# EAGLE design Arduino_Clock_Dividerx4_board2 (EAGLE 9.1.1)
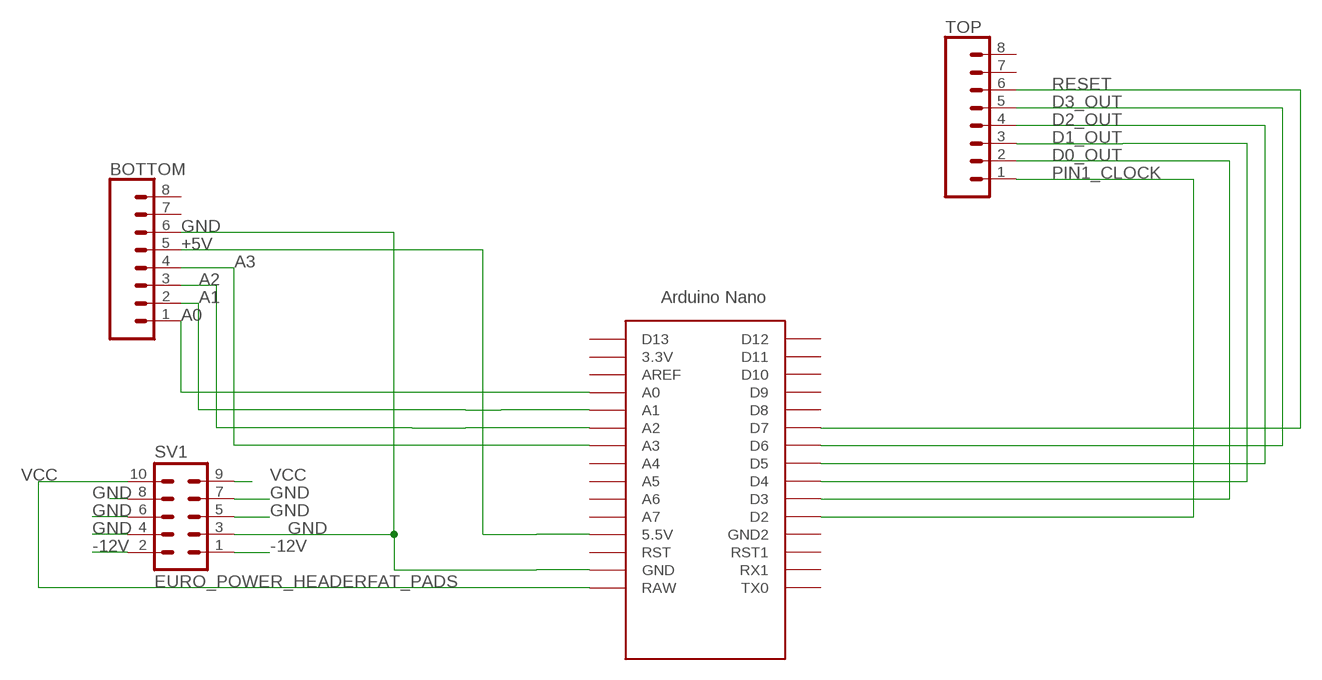
[diagram p0: schematic, sheet 1]

## Parts
BOTTOM  CONN_08LONGPADS  [1X08_LONGPADS]
SV1  EURO_POWER_HEADERFAT_PADS  [EURO_PWR_HEADER_FAT]
TOP  CONN_08LONGPADS  [1X08_LONGPADS]
U$1  NANO  [NANO]

## Nets
+5V: BOTTOM.5 U$1.5V(5.5V)
-12V: SV1.1 SV1.2
A0: BOTTOM.1 U$1.A0
A1: BOTTOM.2 U$1.A1
A2: BOTTOM.3 U$1.A2
A3: BOTTOM.4 U$1.A3
D0_OUT: TOP.2 U$1.D3
D1_OUT: TOP.3 U$1.D4
D2_OUT: TOP.4 U$1.D5
D3_OUT: TOP.5 U$1.D6
GND: BOTTOM.6 SV1.3 SV1.4 SV1.5 SV1.6 SV1.7 SV1.8 U$1.GND
PIN1_CLOCK: TOP.1 U$1.D2
RESET: TOP.6 U$1.D7
VCC: SV1.9 SV1.10 U$1.RAW
Unconnected: BOTTOM.7 BOTTOM.8 TOP.7 TOP.8 U$1.3.3V U$1.A4 U$1.A5 U$1.A6 U$1.A7 U$1.AREF U$1.D8 U$1.D9 U$1.D10 U$1.D11 U$1.D12 U$1.D13 U$1.GND1(GND2) U$1.RST U$1.RST1 U$1.RX1 U$1.TX0

## Library data of the parts
BOTTOM TOP = SparkFun-Connectors:CONN_08: Multi connection point. Often used as Generic Header-pin footprint for 0.1 inch spaced/style header connections On any of the 0.1 inch spaced packages, you can populate with these: Break Away Headers - Straight <https://www.sparkfun.com/products/116> (PRT-00116) Break Away Male Headers - Right Angle <https://www.sparkfun.com/products/553> (PRT-00553) Female Headers <https://www.sparkfun.com/products/115> (PRT-00115) Break Away Headers - Machine Pin <https://www.sparkfun.com/products/117> (PRT-00117) Break Away Female Headers - Swiss Machine Pin <https://www.sparkfun.com/products/743> (PRT-00743) Arduino Stackable Header - 8 Pin <https://www.sparkfun.com/products/9279> (PRT-09279) For SCREWTERMINALS and SPRING TERMINALS visit here: Screw Terimnals on SparkFun.com <https://www.sparkfun.com/search/results?term=Screw+Terminals> (5mm/3.5mm/2.54mm spacing) This device is also useful as a general connection point to wire up your design to another part of your project. Our various solder wires solder well into these plated through hole pads. Hook-Up Wire - Assortment (Stranded, 22 AWG) <https://www.sparkfun.com/products/11375> (PRT-11375) Hook-Up Wire - Assortment (Solid Core, 22 AWG) <https://www.sparkfun.com/products/11367> (PRT-11367) View the entire wire category on our website here <https://www.sparkfun.com/categories/141> Special notes: Molex polarized connector foot print use with SKU : PRT-08231 with associated crimp pins and housings. 1MM SMD Version SKU: PRT-10208 NOTES ON THE VARIANTS LOCK and LOCK_LONGPADS... This footprint was designed to help hold the alignment of a through-hole component (i.e. 6-pin header) while soldering it into place. You may notice that each hole has been shifted either up or down by 0.005 of an inch from it's more standard position (which is a perfectly straight line). This slight alteration caused the pins (the squares in the middle) to touch the edges of the holes. Because they are alternating, it causes a "brace" to hold the component in place. 0.005 has proven to be the perfect amount of "off-center" position when using our standard breakaway headers. Although looks a little odd when you look at the bare footprint, once you have a header in there, the alteration is very hard to notice. Also,if you push a header all the way into place, it is covered up entirely on the bottom side.
SV1 = MusicThingModular:EURO_POWER_HEADER: Power Header 10 pin power header for Eurorack Power Supplies Variants with fatter pads for easier soldering, and the LOCK variant which has 5mil offset pins to hold the component in place before soldering
U$1 = Arduino-clone_EDITED:NANO: Arduino Nano

## Board
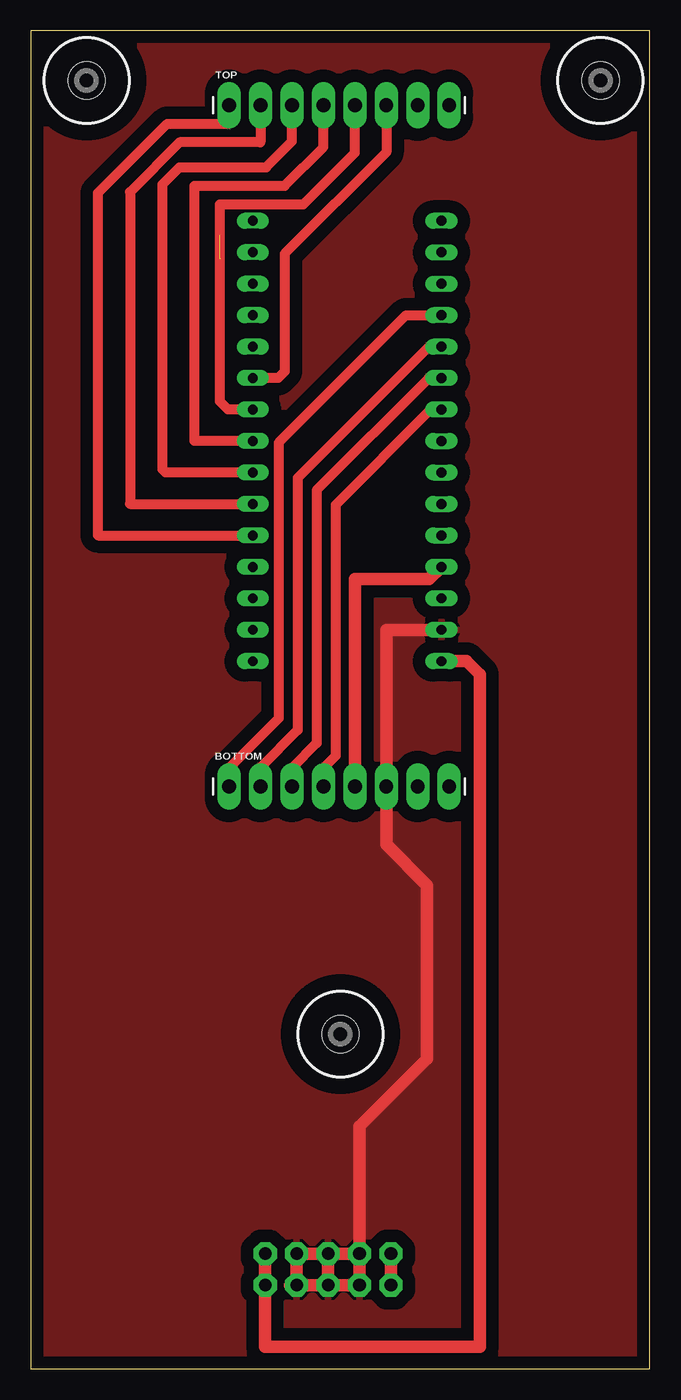
[diagram p1: board, top side]
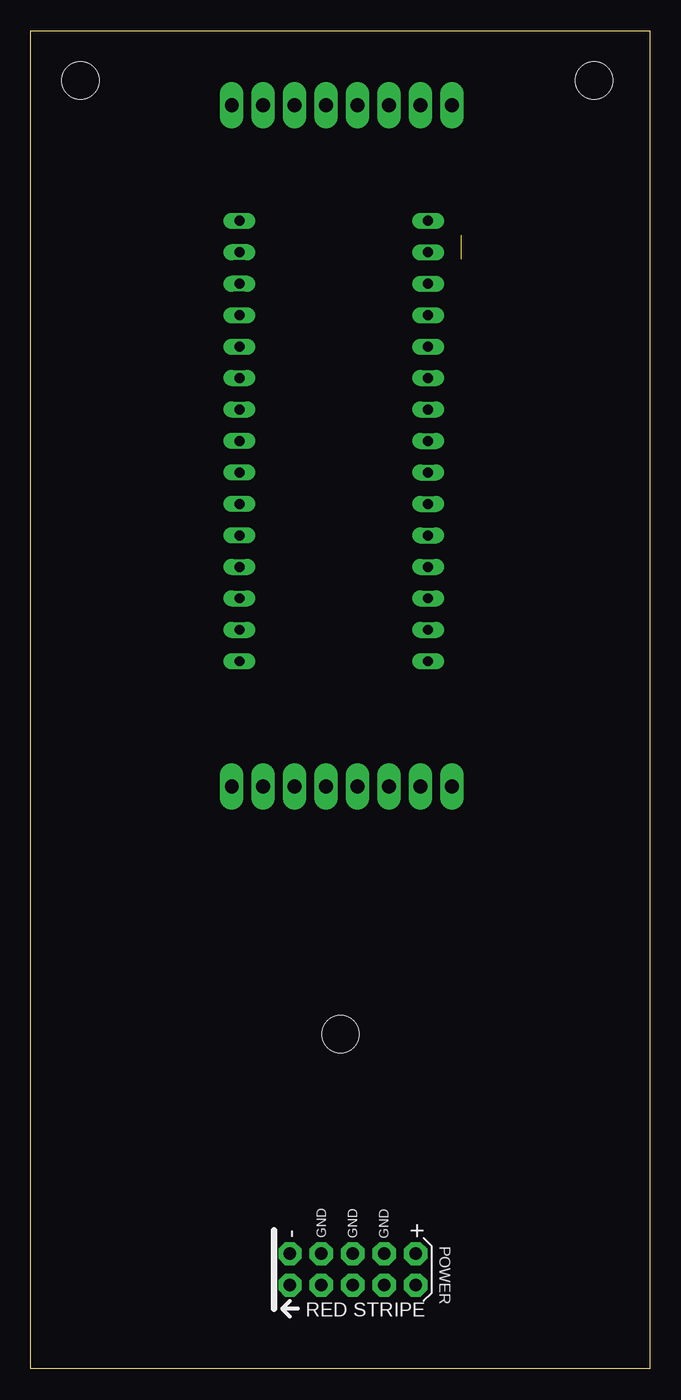
[diagram p2: board, bottom side, seen from below]

Size 50 x 108 mm. Coordinates in mm from the lower left corner, seen from the top.
Outline: 0,0 50,0 50,108 0,108 0,0
Copper layers (1*16): Top 0.035mm / dielectric 1.5mm / Bottom 0.035mm
Design rules "default": minimum track width 6mil, minimum drill 0.35mm, track to track 6mil, track to pad 6mil, pad to pad 6mil, via to via 6mil, smd to smd 6mil, copper to edge 40mil, drill to drill 6mil, minimum pad ring 10mil, minimum via ring 8mil, stop-mask expansion 4mil, vias tented up to drill 0mil, thermal gap 10mil

### Footprints (pad centres in the part's own frame; a part is rotated, then mirrored left to right if it is on the bottom)
1X08_LONGPADS = drill 1.118 pad 1.88 long: 1 0,0; 2 2.54,0; 3 5.08,0; 4 7.62,0; 5 10.16,0; 6 12.7,0; 7 15.24,0; 8 17.78,0
DRIL-3 = hole 3: 0,0
EURO_PWR_HEADER_FAT = drill 1.016 pad 1.88 octagon: 1 -5.08,-1.27; 2 -5.08,1.27; 3 -2.54,-1.27; 4 -2.54,1.27; 5 0,-1.27; 6 0,1.27; 7 2.54,-1.27; 8 2.54,1.27; 9 5.08,-1.27; 10 5.08,1.27
NANO = drill 0.8 long: 3.3V -10.16,24.13; 5V -10.16,-1.27; A0 -10.16,19.05; A1 -10.16,16.51; A2 -10.16,13.97; A3 -10.16,11.43; A4 -10.16,8.89; A5 -10.16,6.35; A6 -10.16,3.81; A7 -10.16,1.27; AREF -10.16,21.59; D2 5.08,1.27; D3 5.08,3.81; D4 5.08,6.35; D5 5.08,8.89; D6 5.08,11.43; D7 5.08,13.97; D8 5.08,16.51; D9 5.08,19.05; D10 5.08,21.59; D11 5.08,24.13; D12 5.08,26.67; D13 -10.16,26.67; GND -10.16,-6.35; GND1 5.08,-1.27; RAW -10.16,-8.89; RST -10.16,-3.81; RST1 5.08,-3.81; RX1 5.08,-6.35; TX0 5.08,-8.89

### Placement (x,y rotation side)
BOTTOM  16,47 0 top
H1  [DRIL-3]  4.5,104 0 top
H2  [DRIL-3]  46,104 0 top
H4  [DRIL-3]  25,27 0 top
SV1  24,8 0 bottom
TOP  16,102 0 top
U$1  23,66 0 bottom

### Tracks (layer width: path | path; a pad name or v marks a point on that pad's centre or on a via)
+5V
  Top 1.016: BOTTOM.5 26.16,63.73 32.16,63.73 U$1.5V
-12V
  Top 1.016: SV1.2 SV1.1
A0
  Top 0.813: U$1.A0 30.3,85.05 20,74.75 20,52.5 16,48.5 BOTTOM.1
A1
  Top 0.813: U$1.A1 32.14,82.51 21.54,71.91 21.54,51.54 18.54,48.54 BOTTOM.2
A2
  Top 0.813: U$1.A2 32.14,79.97 23.08,70.91 23.08,50.5 21.08,48.5 BOTTOM.3
A3
  Top 0.813: U$1.A3 33.02,77.29 32.16,77.29 24.62,69.75 24.62,49.5 23.62,48.5 BOTTOM.4
D0_OUT
  Top 0.813: U$1.D3 8,69.81 8,95 12,99 18.54,99 TOP.2
D1_OUT
  Top 0.813: U$1.D4 10.87,72.35 10.62,72.6 10.62,95.62 12,97 19,97 21.08,99.08 TOP.3
D2_OUT
  Top 0.813: U$1.D5 13.22,74.89 13.22,95.5 15.5,95.5 20.5,95.5 23.62,98.62 TOP.4
D3_OUT  (1 unrouted)
  Top 0.813: 15.25,89.59 15.25,94 22,94 26.16,98.16 TOP.5 | 15.25,91.5 15.25,78.1 15.92,77.43 U$1.D6
GND
  Top 1.016: SV1.6 SV1.8 SV1.7 | SV1.5 SV1.6 | SV1.6 SV1.4 | SV1.7 20.92,6.73 | SV1.7 SV1.5 | SV1.5 SV1.3 SV1.4 | SV1.4 26.54,19.54 32,25 32,39 28.7,42.3 BOTTOM.6 28.7,50.5 28.7,59.65 U$1.GND
  pour Top (isolate 1): 0,0 0,108 50,108 50,0
PIN1_CLOCK
  Top 0.813: U$1.D2 5.42,67.27 5.42,94.92 11,100.5 16,100.5 TOP.1
RESET
  Top 0.813: TOP.6 28.7,98.2 20.5,90 20.5,80.5 19.97,79.97 U$1.D7
VCC
  Top 1.016: SV1.10 SV1.9 18.92,1.75 36.25,1.75 36.25,56.02 35.16,57.11 U$1.RAW